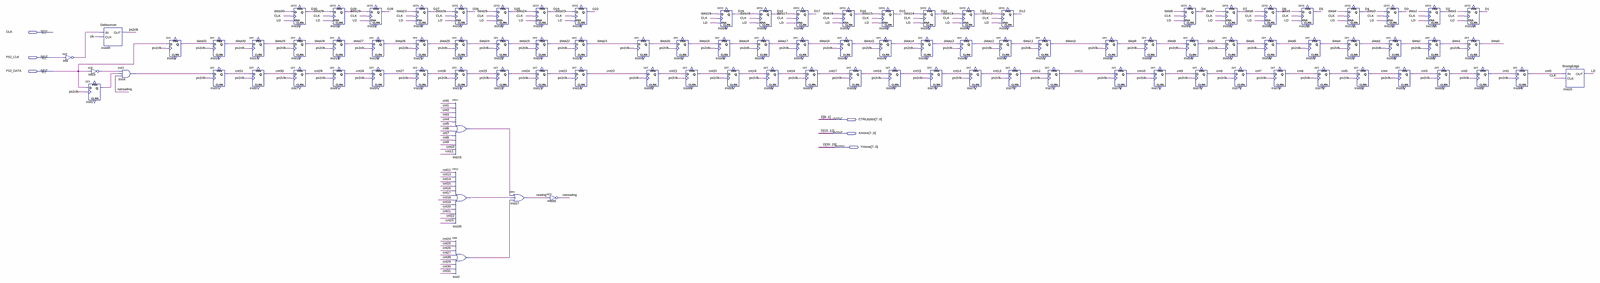
[diagram p0: schematic sheet, whole]
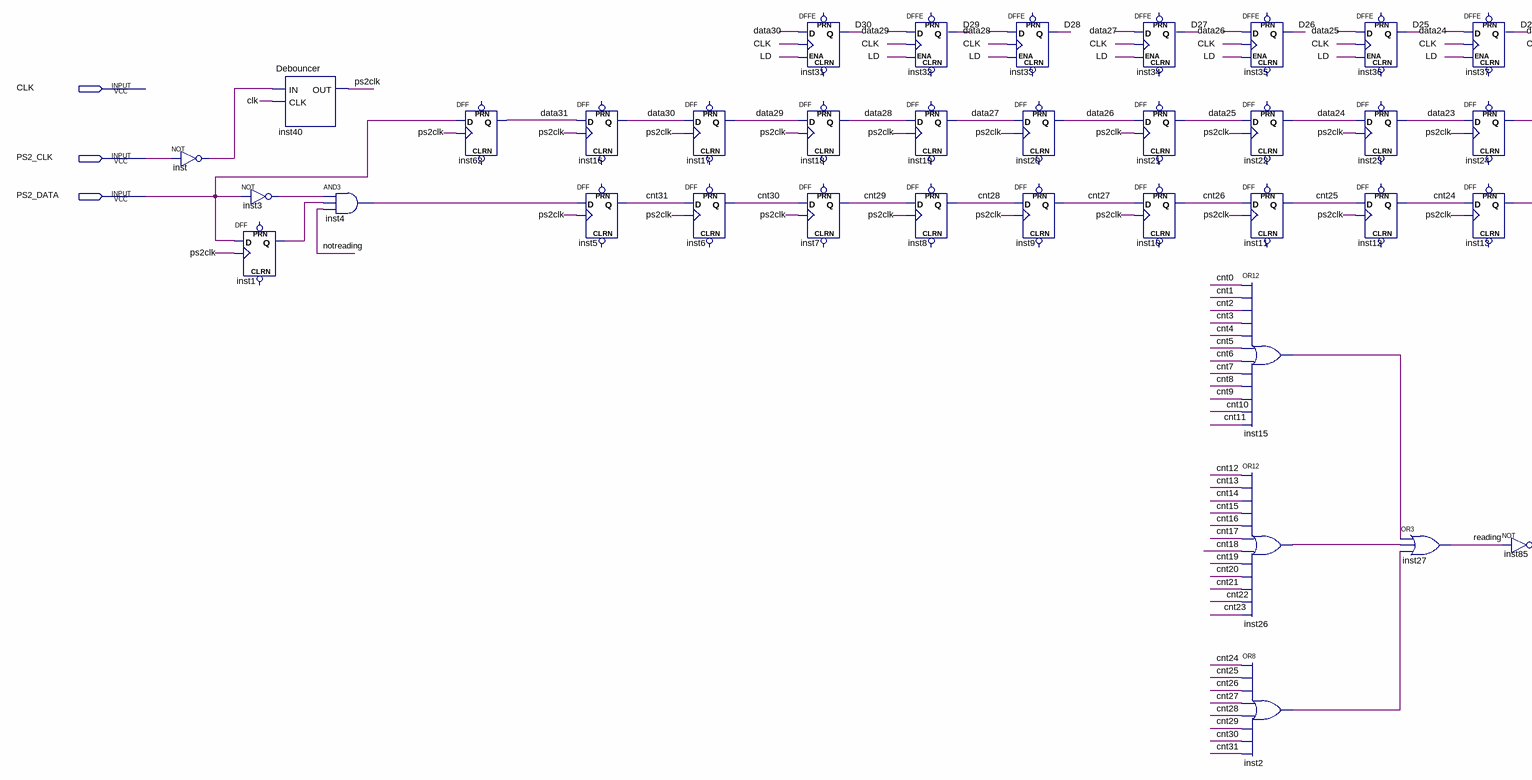
[diagram p1: schematic sheet, left part]
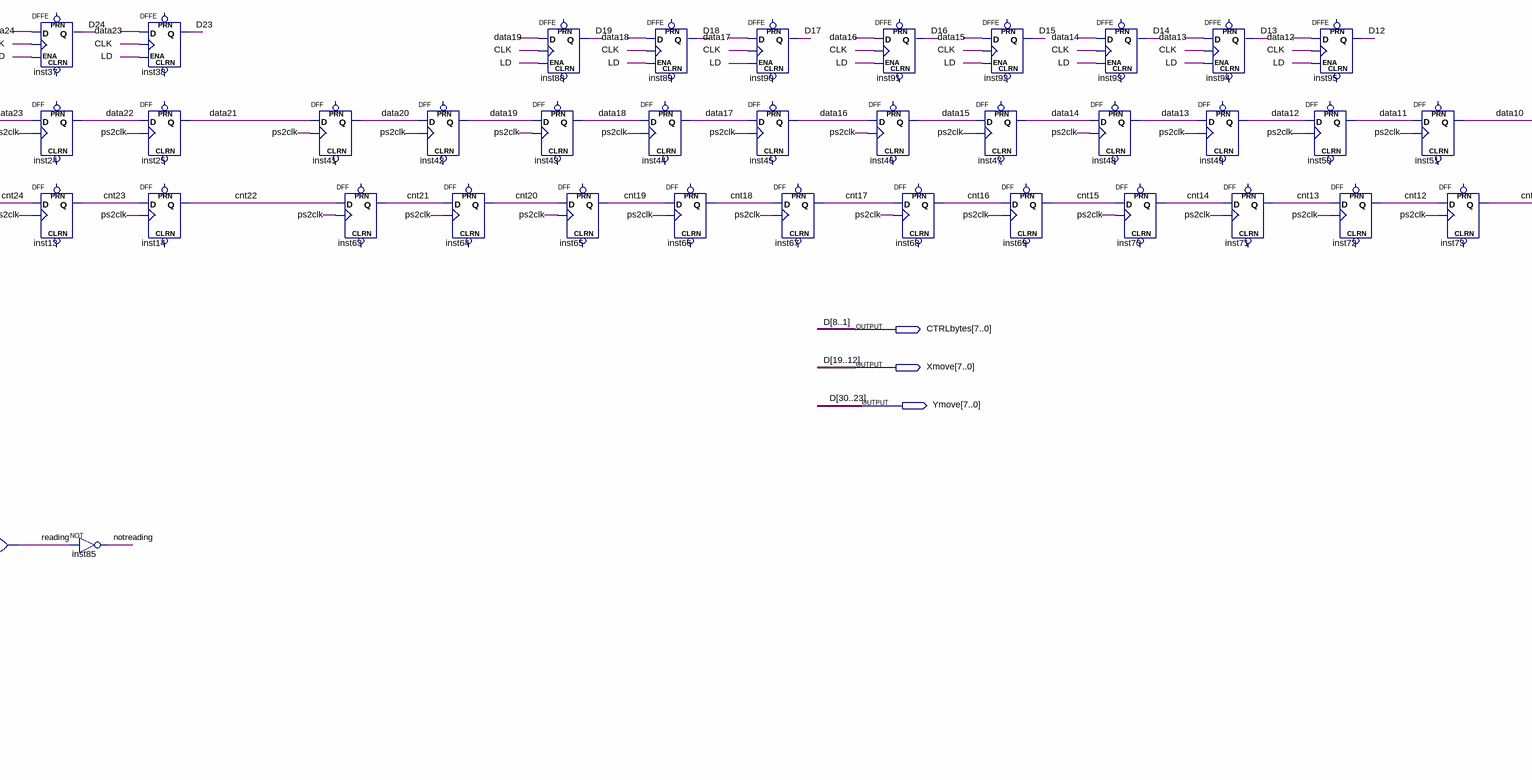
[diagram p2: schematic sheet, centre part]
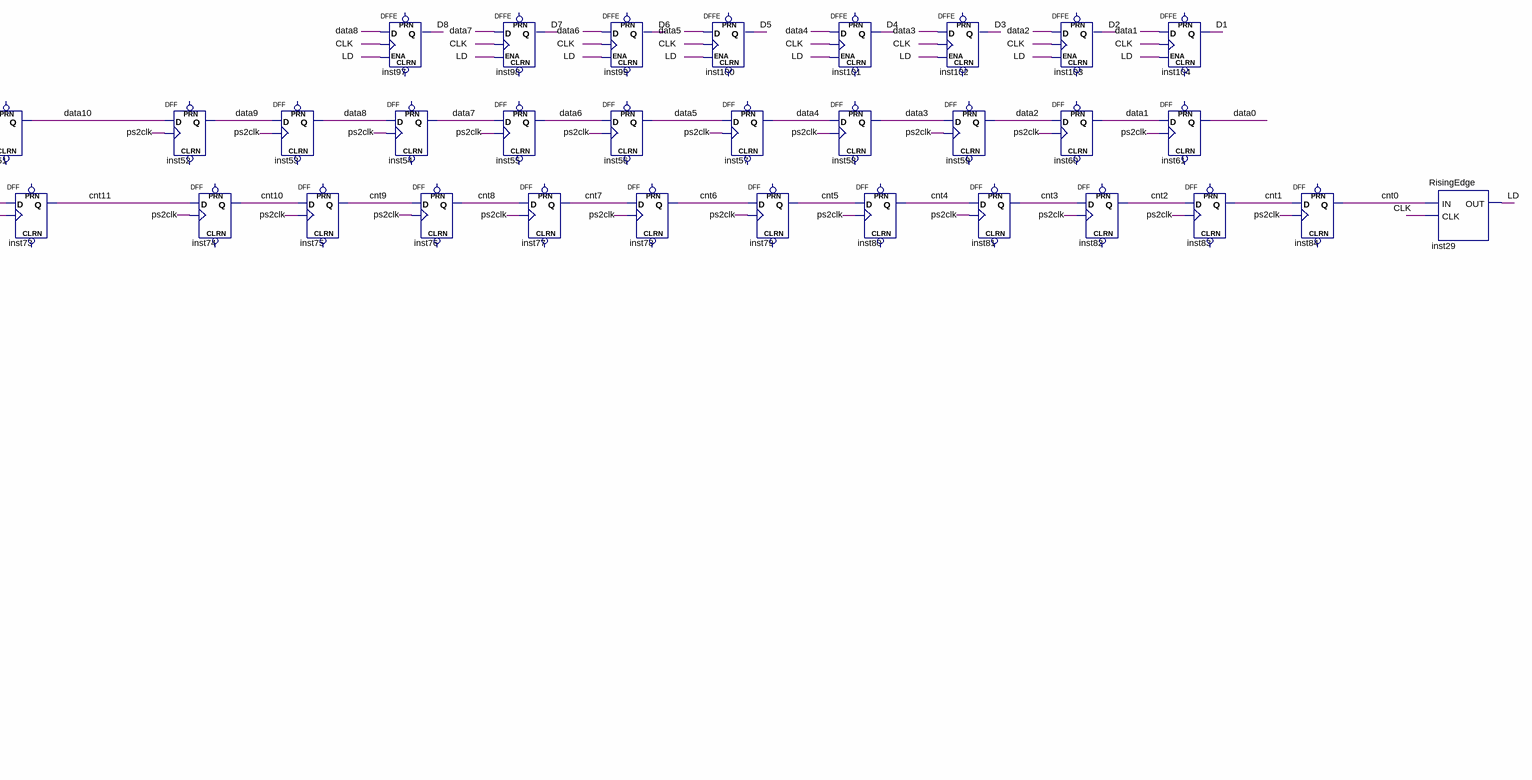
[diagram p3: schematic sheet, right part]
// Quartus schematic KeyboardInterface.bdf as structural Verilog: 99 symbols, 6 pins
module KeyboardInterface (
  input  CLK,
  input  PS2_CLK,
  input  PS2_DATA,
  output [7:0] CTRLbytes,
  output [7:0] Xmove,
  output [7:0] Ymove
);

  wire cnt0, cnt1, cnt2, cnt3, cnt4, cnt5, cnt6, cnt7, cnt8, cnt9, cnt10, cnt11, cnt12, cnt13, cnt14, cnt15,
       cnt16, cnt17, cnt18, cnt19, cnt20, cnt21, cnt22, cnt23, cnt24, cnt25, cnt26, cnt27, cnt28, cnt29,
       cnt30, cnt31, data0, data1, data2, data3, data4, data5, data6, data7, data8, data9, data10, data11,
       data12, data13, data14, data15, data16, data17, data18, data19, data20, data21, data22, data23,
       data24, data25, data26, data27, data28, data29, data30, data31, inst1_q, inst2_out, inst3_out,
       inst4_out, inst15_out, inst26_out, inst_out, LD, notreading, ps2clk, reading;

  not inst (inst_out, PS2_CLK);
  not inst3 (inst3_out, PS2_DATA);
  DFF inst1 (.CLK(ps2clk), .D(PS2_DATA), .Q(inst1_q));  // open: CLRN, PRN
  Debouncer inst40 (.IN(inst_out), .CLK(CLK), .OUT(ps2clk));
  and inst4 (inst4_out, inst3_out, inst1_q, notreading);
  DFF inst62 (.CLK(ps2clk), .D(PS2_DATA), .Q(data31));  // open: CLRN, PRN
  DFF inst16 (.CLK(ps2clk), .D(data31), .Q(data30));  // open: CLRN, PRN
  DFF inst5 (.CLK(ps2clk), .D(inst4_out), .Q(cnt31));  // open: CLRN, PRN
  DFF inst17 (.CLK(ps2clk), .D(data30), .Q(data29));  // open: CLRN, PRN
  DFF inst6 (.CLK(ps2clk), .D(cnt31), .Q(cnt30));  // open: CLRN, PRN
  DFFE inst31 (.D(data30), .CLK(CLK), .ENA(LD), .Q(Ymove[7]));  // open: PRN, CLRN
  DFF inst18 (.CLK(ps2clk), .D(data29), .Q(data28));  // open: CLRN, PRN
  DFF inst7 (.CLK(ps2clk), .D(cnt30), .Q(cnt29));  // open: CLRN, PRN
  DFFE inst32 (.D(data29), .CLK(CLK), .ENA(LD), .Q(Ymove[6]));  // open: PRN, CLRN
  DFF inst19 (.CLK(ps2clk), .D(data28), .Q(data27));  // open: CLRN, PRN
  DFF inst8 (.CLK(ps2clk), .D(cnt29), .Q(cnt28));  // open: CLRN, PRN
  DFFE inst33 (.D(data28), .CLK(CLK), .ENA(LD), .Q(Ymove[5]));  // open: PRN, CLRN
  DFF inst20 (.CLK(ps2clk), .D(data27), .Q(data26));  // open: CLRN, PRN
  DFF inst9 (.CLK(ps2clk), .D(cnt28), .Q(cnt27));  // open: CLRN, PRN
  DFFE inst34 (.D(data27), .CLK(CLK), .ENA(LD), .Q(Ymove[4]));  // open: PRN, CLRN
  DFF inst21 (.CLK(ps2clk), .D(data26), .Q(data25));  // open: CLRN, PRN
  DFF inst10 (.CLK(ps2clk), .D(cnt27), .Q(cnt26));  // open: CLRN, PRN
  DFFE inst35 (.D(data26), .CLK(CLK), .ENA(LD), .Q(Ymove[3]));  // open: PRN, CLRN
  DFF inst22 (.CLK(ps2clk), .D(data25), .Q(data24));  // open: CLRN, PRN
  DFF inst11 (.CLK(ps2clk), .D(cnt26), .Q(cnt25));  // open: CLRN, PRN
  or inst15 (inst15_out, cnt0, cnt1, cnt2, cnt3, cnt4, cnt5, cnt6, cnt7, cnt8, cnt9, cnt10, cnt11);
  or inst26 (inst26_out, cnt12, cnt13, cnt14, cnt15, cnt16, cnt17, cnt18, cnt19, cnt20, cnt21, cnt22, cnt23);
  or inst2 (inst2_out, cnt24, cnt25, cnt26, cnt27, cnt28, cnt29, cnt30, cnt31);
  DFFE inst36 (.D(data25), .CLK(CLK), .ENA(LD), .Q(Ymove[2]));  // open: PRN, CLRN
  DFF inst23 (.CLK(ps2clk), .D(data24), .Q(data23));  // open: CLRN, PRN
  DFF inst12 (.CLK(ps2clk), .D(cnt25), .Q(cnt24));  // open: CLRN, PRN
  or inst27 (reading, inst15_out, inst26_out, inst2_out);
  DFFE inst37 (.D(data24), .CLK(CLK), .ENA(LD), .Q(Ymove[1]));  // open: PRN, CLRN
  DFF inst24 (.CLK(ps2clk), .D(data23), .Q(data22));  // open: CLRN, PRN
  DFF inst13 (.CLK(ps2clk), .D(cnt24), .Q(cnt23));  // open: CLRN, PRN
  not inst85 (notreading, reading);
  DFFE inst38 (.D(data23), .CLK(CLK), .ENA(LD), .Q(Ymove[0]));  // open: PRN, CLRN
  DFF inst25 (.CLK(ps2clk), .D(data22), .Q(data21));  // open: CLRN, PRN
  DFF inst14 (.CLK(ps2clk), .D(cnt23), .Q(cnt22));  // open: CLRN, PRN
  DFF inst41 (.CLK(ps2clk), .D(data21), .Q(data20));  // open: CLRN, PRN
  DFF inst63 (.CLK(ps2clk), .D(cnt22), .Q(cnt21));  // open: CLRN, PRN
  DFF inst42 (.CLK(ps2clk), .D(data20), .Q(data19));  // open: CLRN, PRN
  DFF inst64 (.CLK(ps2clk), .D(cnt21), .Q(cnt20));  // open: CLRN, PRN
  DFFE inst88 (.D(data19), .CLK(CLK), .ENA(LD), .Q(Xmove[7]));  // open: PRN, CLRN
  DFF inst43 (.CLK(ps2clk), .D(data19), .Q(data18));  // open: CLRN, PRN
  DFF inst65 (.CLK(ps2clk), .D(cnt20), .Q(cnt19));  // open: CLRN, PRN
  DFFE inst89 (.D(data18), .CLK(CLK), .ENA(LD), .Q(Xmove[6]));  // open: PRN, CLRN
  DFF inst44 (.CLK(ps2clk), .D(data18), .Q(data17));  // open: CLRN, PRN
  DFF inst66 (.CLK(ps2clk), .D(cnt19), .Q(cnt18));  // open: CLRN, PRN
  DFFE inst90 (.D(data17), .CLK(CLK), .ENA(LD), .Q(Xmove[5]));  // open: PRN, CLRN
  DFF inst45 (.CLK(ps2clk), .D(data17), .Q(data16));  // open: CLRN, PRN
  DFF inst67 (.CLK(ps2clk), .D(cnt18), .Q(cnt17));  // open: CLRN, PRN
  DFFE inst91 (.D(data16), .CLK(CLK), .ENA(LD), .Q(Xmove[4]));  // open: PRN, CLRN
  DFF inst46 (.CLK(ps2clk), .D(data16), .Q(data15));  // open: CLRN, PRN
  DFF inst68 (.CLK(ps2clk), .D(cnt17), .Q(cnt16));  // open: CLRN, PRN
  DFFE inst92 (.D(data15), .CLK(CLK), .ENA(LD), .Q(Xmove[3]));  // open: PRN, CLRN
  DFF inst47 (.CLK(ps2clk), .D(data15), .Q(data14));  // open: CLRN, PRN
  DFF inst69 (.CLK(ps2clk), .D(cnt16), .Q(cnt15));  // open: CLRN, PRN
  DFFE inst93 (.D(data14), .CLK(CLK), .ENA(LD), .Q(Xmove[2]));  // open: PRN, CLRN
  DFF inst48 (.CLK(ps2clk), .D(data14), .Q(data13));  // open: CLRN, PRN
  DFF inst70 (.CLK(ps2clk), .D(cnt15), .Q(cnt14));  // open: CLRN, PRN
  DFFE inst94 (.D(data13), .CLK(CLK), .ENA(LD), .Q(Xmove[1]));  // open: PRN, CLRN
  DFF inst49 (.CLK(ps2clk), .D(data13), .Q(data12));  // open: CLRN, PRN
  DFF inst71 (.CLK(ps2clk), .D(cnt14), .Q(cnt13));  // open: CLRN, PRN
  DFF inst50 (.CLK(ps2clk), .D(data12), .Q(data11));  // open: CLRN, PRN
  DFFE inst95 (.D(data12), .CLK(CLK), .ENA(LD), .Q(Xmove[0]));  // open: PRN, CLRN
  DFF inst72 (.CLK(ps2clk), .D(cnt13), .Q(cnt12));  // open: CLRN, PRN
  DFF inst51 (.CLK(ps2clk), .D(data11), .Q(data10));  // open: CLRN, PRN
  DFF inst73 (.CLK(ps2clk), .D(cnt12), .Q(cnt11));  // open: CLRN, PRN
  DFF inst52 (.CLK(ps2clk), .D(data10), .Q(data9));  // open: CLRN, PRN
  DFF inst74 (.CLK(ps2clk), .D(cnt11), .Q(cnt10));  // open: CLRN, PRN
  DFF inst53 (.CLK(ps2clk), .D(data9), .Q(data8));  // open: CLRN, PRN
  DFF inst75 (.CLK(ps2clk), .D(cnt10), .Q(cnt9));  // open: CLRN, PRN
  DFFE inst97 (.D(data8), .CLK(CLK), .ENA(LD), .Q(CTRLbytes[7]));  // open: PRN, CLRN
  DFF inst54 (.CLK(ps2clk), .D(data8), .Q(data7));  // open: CLRN, PRN
  DFF inst76 (.CLK(ps2clk), .D(cnt9), .Q(cnt8));  // open: CLRN, PRN
  DFFE inst98 (.D(data7), .CLK(CLK), .ENA(LD), .Q(CTRLbytes[6]));  // open: PRN, CLRN
  DFF inst55 (.CLK(ps2clk), .D(data7), .Q(data6));  // open: CLRN, PRN
  DFF inst77 (.CLK(ps2clk), .D(cnt8), .Q(cnt7));  // open: CLRN, PRN
  DFFE inst99 (.D(data6), .CLK(CLK), .ENA(LD), .Q(CTRLbytes[5]));  // open: PRN, CLRN
  DFF inst56 (.CLK(ps2clk), .D(data6), .Q(data5));  // open: CLRN, PRN
  DFF inst78 (.CLK(ps2clk), .D(cnt7), .Q(cnt6));  // open: CLRN, PRN
  DFFE inst100 (.D(data5), .CLK(CLK), .ENA(LD), .Q(CTRLbytes[4]));  // open: PRN, CLRN
  DFF inst57 (.CLK(ps2clk), .D(data5), .Q(data4));  // open: CLRN, PRN
  DFF inst79 (.CLK(ps2clk), .D(cnt6), .Q(cnt5));  // open: CLRN, PRN
  DFFE inst101 (.D(data4), .CLK(CLK), .ENA(LD), .Q(CTRLbytes[3]));  // open: PRN, CLRN
  DFF inst58 (.CLK(ps2clk), .D(data4), .Q(data3));  // open: CLRN, PRN
  DFF inst80 (.CLK(ps2clk), .D(cnt5), .Q(cnt4));  // open: CLRN, PRN
  DFFE inst102 (.D(data3), .CLK(CLK), .ENA(LD), .Q(CTRLbytes[2]));  // open: PRN, CLRN
  DFF inst59 (.CLK(ps2clk), .D(data3), .Q(data2));  // open: CLRN, PRN
  DFF inst81 (.CLK(ps2clk), .D(cnt4), .Q(cnt3));  // open: CLRN, PRN
  DFFE inst103 (.D(data2), .CLK(CLK), .ENA(LD), .Q(CTRLbytes[1]));  // open: PRN, CLRN
  DFF inst60 (.CLK(ps2clk), .D(data2), .Q(data1));  // open: CLRN, PRN
  DFF inst82 (.CLK(ps2clk), .D(cnt3), .Q(cnt2));  // open: CLRN, PRN
  DFFE inst104 (.D(data1), .CLK(CLK), .ENA(LD), .Q(CTRLbytes[0]));  // open: PRN, CLRN
  DFF inst61 (.CLK(ps2clk), .D(data1), .Q(data0));  // open: CLRN, PRN
  DFF inst83 (.CLK(ps2clk), .D(cnt2), .Q(cnt1));  // open: CLRN, PRN
  DFF inst84 (.CLK(ps2clk), .D(cnt1), .Q(cnt0));  // open: CLRN, PRN
  RisingEdge inst29 (.IN(cnt0), .CLK(CLK), .OUT(LD));

  // Other names for the same wires on the sheet: D (some bits) = {Ymove, Xmove, CTRLbytes}; D1 = CTRLbytes[0];
  //   D2 = CTRLbytes[1]; D3 = CTRLbytes[2]; D4 = CTRLbytes[3]; D5 = CTRLbytes[4]; D6 = CTRLbytes[5];
  //   D7 = CTRLbytes[6]; D8 = CTRLbytes[7]; D12 = Xmove[0]; D13 = Xmove[1]; D14 = Xmove[2]; D15 = Xmove[3];
  //   D16 = Xmove[4]; D17 = Xmove[5]; D18 = Xmove[6]; D19 = Xmove[7]; D23 = Ymove[0]; D24 = Ymove[1]; D25 = Ymove[2];
  //   D26 = Ymove[3]; D27 = Ymove[4]; D28 = Ymove[5]; D29 = Ymove[6]; D30 = Ymove[7]
endmodule
